# Altium project PCB_Project.PrjPcb
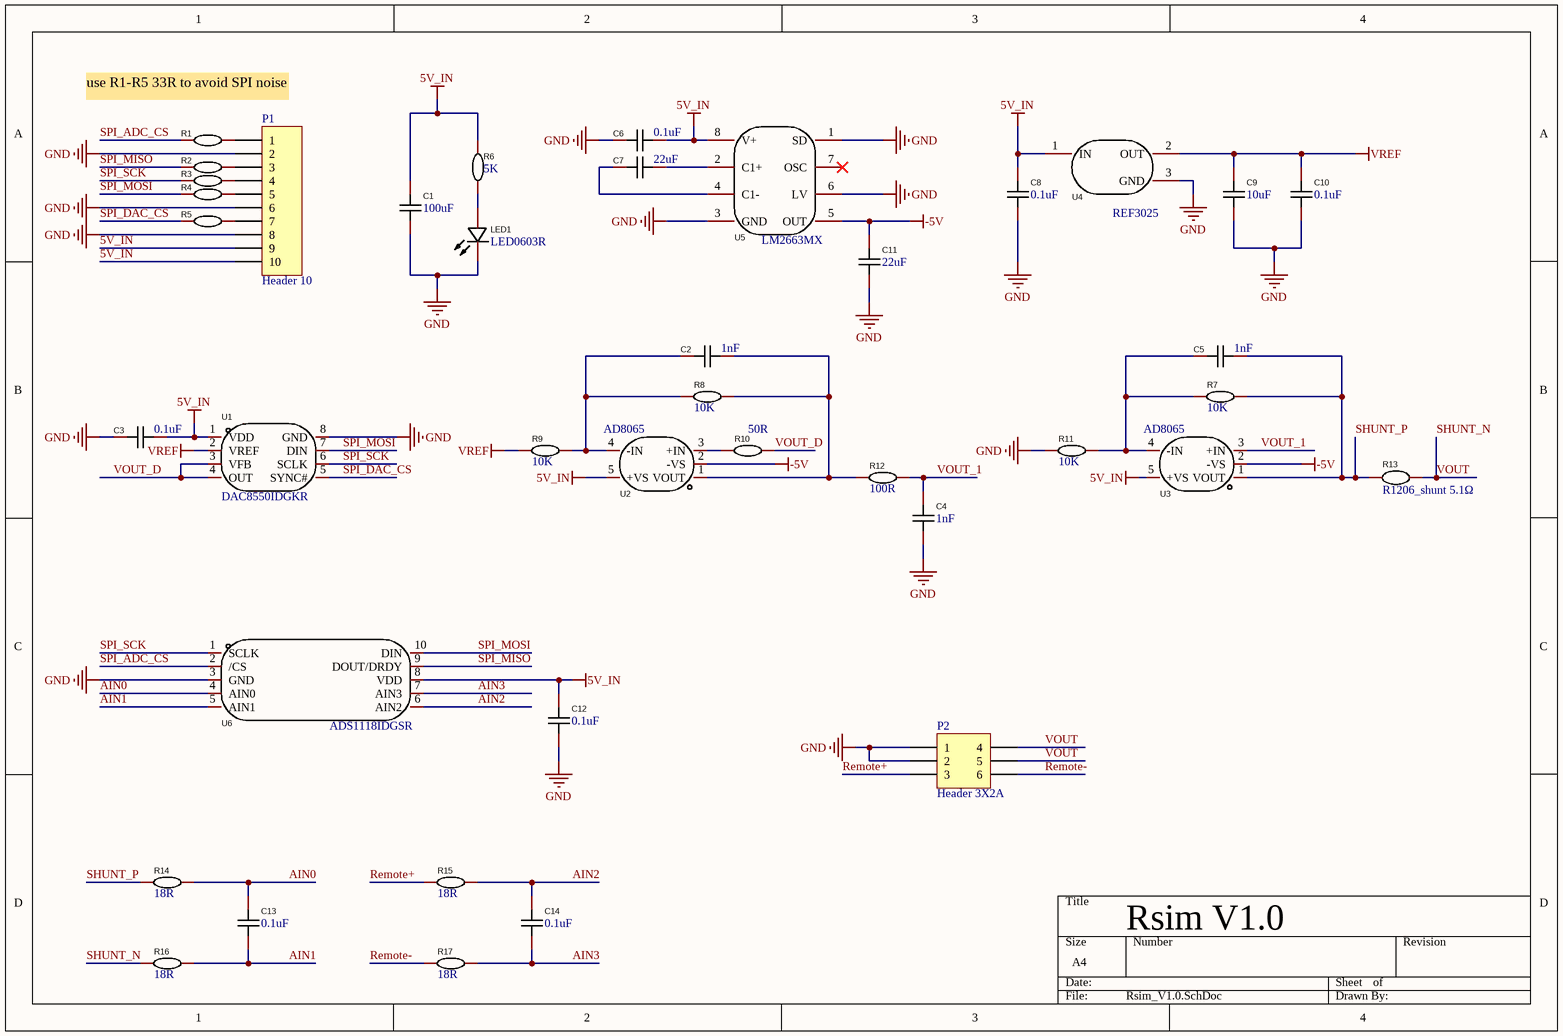
[diagram p0: Rsim_V1.0.SchDoc]
1 sheet, 40 parts. Net scope: global (net labels, ports and power ports of the same name join across sheets).
Board file: Rsim_V1.0.PcbDoc

## Sheet Rsim_V1.0.SchDoc
size A4

### Parts
C1  100uF  [C0603]
C2  1nF  [C0603]
C3  0.1uF  [C0603]
C4  1nF  [C0603]
C5  1nF  [C0603]
C6  0.1uF  [C0603]
C7  22uF  [C0603]
C8  0.1uF  [C0603]
C9  10uF  [C0603]
C10  0.1uF  [C0603]
C11  22uF  [C0603]
C12  0.1uF  [C0603]
C13  0.1uF  [C0603]
C14  0.1uF  [C0603]
LED1  LED0603R  [LED0603-R-RD]
P1  Header 10  [HDR1X10]
P2  Header 3X2A  [HDR2X3_CEN]
R1  33R  [R0603]  (value not drawn)
R2  33R  [R0603]  (value not drawn)
R3  33R  [R0603]  (value not drawn)
R4  33R  [R0603]  (value not drawn)
R5  33R  [R0603]  (value not drawn)
R6  5K  [R0603]
R7  10K  [R0603]
R8  10K  [R0603]
R9  10K  [R0603]
R10  50R  [R0603]
R11  10K  [R0603]
R12  100R  [R0603]
R13  R1206_shunt 5.1Ω  [R1206]
R14  18R  [R0603]
R15  18R  [R0603]
R16  18R  [R0603]
R17  18R  [R0603]
U1  DAC8550IDGKR  [VSSOP-8_L3.0-W3.0-P0.65-LS5.0-BL]
U2  AD8065  [SOT-23-5_L3.0-W1.7-P0.95-LS2.8-BR]
U3  AD8065  [SOT-23-5_L3.0-W1.7-P0.95-LS2.8-BR]
U4  REF3025  [SOT-23-3_L2.9-W1.6-P1.90-LS2.8-BR]
U5  LM2663MX  [SOIC-8_L4.9-W3.9-P1.27-LS6.0-BL]
U6  ADS1118IDGSR  [VSSOP-10_L3.0-W3.0-P0.50-LS4.9-BL]

### Nets
5V_IN: C1.2 C3.1 C6.1 C8.1 C12.1 P1.9 P1.10 R6.2 U1.1(VDD) U2.5(+VS) U3.5(+VS) U4.1(IN) U5.8(V+) U6.8(VDD)
-5V: C11.2 U2.2(-VS) U3.2(-VS) U5.5(OUT)
GND: C1.1 C3.2 C4.2 C6.2 C8.2 C9.2 C10.2 C11.1 C12.2 LED1.2(-) P1.2 P1.6 P1.8 P2.1 P2.2 R11.2 U1.8(GND) U4.3(GND) U5.1(SD) U5.3(GND) U5.6(LV) U6.3(GND)
VREF: C9.1 C10.1 R9.2 U1.2(VREF) U4.2(OUT)
AIN0: C13.1 R14.1 U6.4(AIN0)
AIN1: C13.2 R16.1 U6.5(AIN1)
AIN2: C14.1 R15.1 U6.6(AIN2)
AIN3: C14.2 R17.1 U6.7(AIN3)
Remote+: P2.3 R15.2
Remote-: P2.6 R17.2
SHUNT_N: P2.4 P2.5 R13.2 R16.2  [also labelled VOUT]
SHUNT_P: C5.1 R7.1 R13.1 R14.2 U3.1(VOUT)
SPI_ADC_CS: R1.1 U6.2(/CS)
SPI_DAC_CS: R5.1 U1.5(SYNC#)
SPI_MISO: R2.1 U6.9(DOUT/DRDY)
SPI_MOSI: R4.1 U1.7(DIN) U6.10(DIN)
SPI_SCK: R3.1 U1.6(SCLK) U6.1(SCLK)
VOUT_1: C4.1 R12.1 U3.3(+IN)
VOUT_D: R10.1 U1.3(VFB) U1.4(OUT)
NetC2_1: C2.1 R8.1 R12.2 U2.1(VOUT)
NetC2_2: C2.2 R8.2 R9.1 U2.4(-IN)
NetC5_2: C5.2 R7.2 R11.1 U3.4(-IN)
NetC7_1: C7.1 U5.2(C1+)
NetC7_2: C7.2 U5.4(C1-)
NetLED1_1: LED1.1(+) R6.1
NetP1_1: P1.1 R1.2
NetP1_3: P1.3 R2.2
NetP1_4: P1.4 R3.2
NetP1_5: P1.5 R4.2
NetP1_7: P1.7 R5.2
NetR10_2: R10.2 U2.3(+IN)

Not connected (* = marked no-connect by the designer): U5 7(OSC)*

### Notes on the sheet
- use R1-R5 33R to avoid SPI noise
- Rsim V1.0

### Library data of the parts
C1-C14 = 0603CAP: Manufacturer: FH(风华); Symbol: 0603DS475K160NT; Add into BOM: yes; Device: 0603DS475K160NT; LCSC Part Name: 贴片电容; Supplier Part: C18213190; Manufacturer Part: 0603DS475K160NT; Supplier Footprint: 0603; JLCPCB Part Class: Extended Part; Datasheet: https://atta.szlcsc.com/upload/public/pdf/source/20220211/3FDF6092789FC56E23A16E03DC7301F9.pdf; Supplier: LCSC; Convert to PCB: yes
LED1 = LED0603R: Manufacturer: yongyu(永裕光电); Symbol: SZYY0603R; Add into BOM: yes; Emitted Color: 红色; Power Dissipation: 40mW; Forward Current: 20mA; Dominant Wavelength: 615nm~630nm; Peak Wavelength: 645nm; Lens Color: 无色透明透镜; Viewing Angle: 120°; Device: SZYY0603R; LCSC Part Name: 红灯; Supplier Part: C434419; Manufacturer Part: SZYY0603R; Supplier Footprint: 0603; JLCPCB Part Class: Extended Part; Datasheet: https://atta.szlcsc.com/upload/public/pdf/source/20191204/C434419_0B955C1F73FF88449D9A795B6FF49070.pdf; Supplier: LCSC; Convert to PCB: yes; Diode Configuration: -; Color Temperature: -; Mounting Sytle: -; Operating Temperature: -40℃~+85℃
P1 = Header 10: Header, 10-Pin; LatestRevisionDate: 17-Jul-2002; LatestRevisionNote: Re-released for DXP Platform.; Publisher: Altium Limited
P2 = Header 3X2A: Header, 3-Pin, Dual row; LatestRevisionDate: 17-Jul-2002; LatestRevisionNote: Re-released for DXP Platform.; Publisher: Altium Limited
R1-R12 R14-R17 = 0603RES: Manufacturer: UNI-ROYAL(厚声); Symbol: 0603WAF1002T5E; Value: 10kΩ; Add into BOM: yes; Tolerance: ±1%; Power(Watts): 100mW; Overload Voltage (Max): 75V; Temperature Coefficient: ±100ppm/℃; Device: 0603WAF1002T5E; Supplier: LCSC; Manufacturer Part: 0603WAF1002T5E; Supplier Part: C25804; JLCPCB Part Class: Basic Part; LCSC Part Name: 厚膜电阻 10kΩ ±1% 100mW; Supplier Footprint: 0603; Datasheet: https://atta.szlcsc.com/upload/public/pdf/source/20200306/C422600_1E6D84923E4A46A82E41ADD87F860B5C.pdf; Convert to PCB: yes; Type: 厚膜电阻; Operating Temperature Range: -55℃~+155℃
R13 = R1206_shunt: Manufacturer: Milliohm(毫欧); Symbol: HOLLR1206-1W-5MR-1%; Add into BOM: yes; Value: 5mΩ; Tolerance: ±1%; Power(Watts): 1W; Rated Current: 31.6A; Temperature Coefficient: ±50ppm/℃; Mounting Sytle: 贴片; Device: HoLLR1206-1W-5mR-1%; LCSC Part Name: 5mΩ ±1% 1W; Supplier Part: C2988648; Manufacturer Part: HoLLR1206-1W-5mR-1%; Supplier Footprint: 1206; JLCPCB Part Class: Extended Part; Datasheet: https://atta.szlcsc.com/upload/public/pdf/source/20220407/F189C92CC2C10DCB4BF36375122B9E11.pdf; Supplier: LCSC; Convert to PCB: yes; Type: 采样电阻; Rated Output Voltage: -
U1 = DAC8550IDGKR: Manufacturer: TI(德州仪器); Add into BOM: yes; Symbol: DAC8550IDGKR; Device: DAC8550IDGKR; LCSC Part Name: DAC8550IDGKR; Supplier Part: C2868131; Manufacturer Part: DAC8550IDGKR; Supplier Footprint: VSSOP-8-0.65mm; JLCPCB Part Class: Extended Part; Datasheet: https://www.ti.com/cn/lit/gpn/dac8550; Supplier: LCSC; Convert to PCB: yes
U2 U3 = AD8065ARTZ-REEL7: Manufacturer: ADI(亚德诺); Add into BOM: yes; Slew Rate(SR): 180V/us; Supply Current Per Channel: 6.6mA; Symbol: AD8065ARTZ-REEL7; Device: AD8065ARTZ-REEL7; LCSC Part Name: AD8065ARTZ-REEL7; Supplier Part: C9648; Manufacturer Part: AD8065ARTZ-REEL7; Supplier Footprint: SOT-23-5; JLCPCB Part Class: Extended Part; Datasheet: https://atta.szlcsc.com/upload/public/pdf/source/20190724/C406721_7F0014C6A9B930583CF1868CC468A0F9.pdf; Supplier: LCSC; Convert to PCB: yes; Operating Temperature: -40℃~+85℃
U4 = REF3025AIDBZR: Manufacturer: TI(德州仪器); Add into BOM: yes; Output Type: 固定; Input Voltage: 2.55V~5.5V; Output Voltage: 2.5V; Output Current: 25mA; Tolerance: ±0.2%; Temperature Coefficient: 75ppm/℃; Reference Type: 串联; Supply Current: 50uA; Noise - 1/10Hz to 10Hz: 28uVp-p; Noise - 10Hz to 10kHz: 80uVrms; Symbol: REF3025AIDBZR; Device: REF3025AIDBZR; LCSC Part Name: REF3025AIDBZR; Supplier Part: C11334; Manufacturer Part: REF3025AIDBZR; Supplier Footprint: SOT-23; JLCPCB Part Class: Extended Part; Datasheet: https://www.ti.com/cn/lit/gpn/ref3020; Supplier: LCSC; Convert to PCB: yes; Operating Temperature: -40℃~+125℃@(Ta)
U5 = LM2663MX/NOPB: Manufacturer: TI(德州仪器); Add into BOM: yes; Output Type: 固定; Input Voltage: 1.5V~5.5V; Output Voltage: -5.5V~-1.5V; Output Current (Max): 200mA; Switching Frequency: 75kHz；10kHz; Synchronous Rectification: 否; Number of Outputs: 1; Switch tube (built-in/external): 内置; Symbol: LM2663MX/NOPB; Device: LM2663MX/NOPB; LCSC Part Name: LM2663MX/NOPB; Supplier Part: C73869; Manufacturer Part: LM2663MX/NOPB; Supplier Footprint: SOIC-8; JLCPCB Part Class: Extended Part; Datasheet: https://www.ti.com/cn/lit/gpn/lm2662; Supplier: LCSC; Convert to PCB: yes; Function: -; Operating Temperature: -40℃~+85℃@(TA); Topology: -
U6 = ADS1118IDGSR: Manufacturer: TI(德州仪器); Symbol: ADS1118IDGSR_C55347; Add into BOM: yes; Device: ADS1118IDGSR; Supplier: LCSC; Supplier Part: C55347; Manufacturer Part: ADS1118IDGSR; JLCPCB Part Class: Extended Part; LCSC Part Name: ADS1118IDGSR; Supplier Footprint: VSSOP-10-0.5mm; Datasheet: https://www.ti.com/cn/lit/gpn/ads1118; Convert to PCB: yes